# Altium schematic sheet rhd_board.SchDoc
size A4
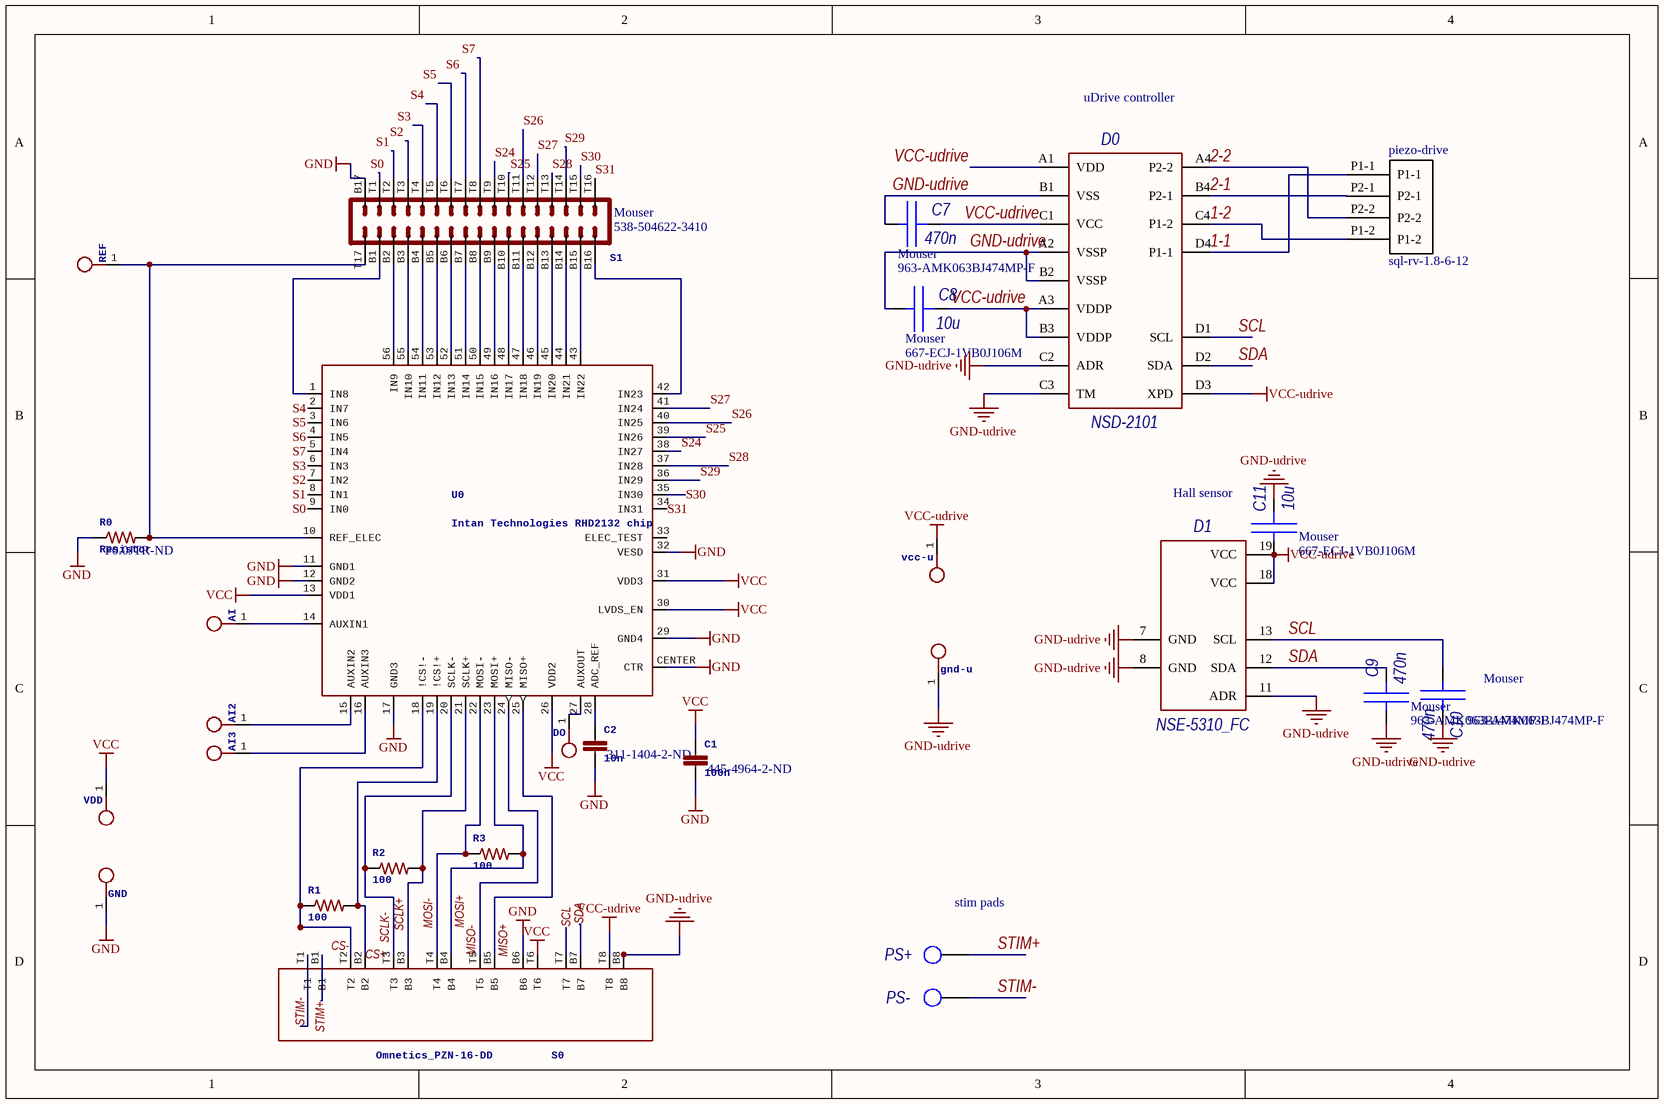
[diagram p0: rhd_board.SchDoc]

## Parts
AI  PCB Test Point  [TESTPOINT_SMALL]  (value not drawn)
AI2  PCB Test Point  [TESTPOINT_SMALL]  (value not drawn)
AI3  PCB Test Point  [TESTPOINT_SMALL]  (value not drawn)
C1  100n  Supplier Part Number 1: 445-4964-2-ND  [0402]
C2  10n  Supplier Part Number 1: 311-1404-2-ND  [0201]
C7  470n  Supplier 1: Mouser  Supplier Part Number 1: 963-AMK063BJ474MP-F  [CAPC0603X03L]
C8  10u  Supplier 1: Mouser  Supplier Part Number 1: 667-ECJ-1VB0J106M  [CAPC1608X09L]
C9  470n  Supplier 1: Mouser  Supplier Part Number 1: 963-AMK063BJ474MP-F  [CAPC0603X03L]
C10  470n  Supplier 1: Mouser  Supplier Part Number 1: 963-AMK063BJ474MP-F  [CAPC0603X03L]
C11  10u  Supplier 1: Mouser  Supplier Part Number 1: 667-ECJ-1VB0J106M  [CAPC1608X09L]
D0  NSD-2101  [BGA16C40P4X4_175X175X63]
D1  NSE-5310_FC  [NSE-5310_FC]
DO  PCB Test Point  [TESTPOINT_SMALL]  (value not drawn)
GND  PCB Test Point  [TESTPOINT_SMALL]  (value not drawn)
gnd-u  PCB Test Point  [TESTPOINT_SMALL]  (value not drawn)
piezo-drive  sql-rv-1.8-6-12  [sql-rv-1.8-6-12]
PS+  2-2  [KP-025-04]  (value not drawn)
PS-  2-2  [KP-025-04]  (value not drawn)
R0  Resistor  Supplier Part Number 1: P0.0JTR-ND  [0402]
R1  100  [0201]
R2  100  [0201]
R3  100  [0201]
REF  PCB Test Point  [TESTPOINT_SMALL]  (value not drawn)
S0  Omnetics_PZN-16-DD  [OMNETICS_PZN-16-DD]
S1  Supplier 1: Mouser  Supplier Part Number 1: 538-504622-3410  [MOLEX_504622-3412]  (hidden comment: Molex 3.5mm Pitch Slimstack 34 pin connector)
U0  Intan Technologies RHD2132 chip  [RHD2000_56PIN_COB]
vcc-u  PCB Test Point  [TESTPOINT_SMALL]  (value not drawn)
VDD  PCB Test Point  [TESTPOINT_SMALL]  (value not drawn)

## Nets
GND: C1.2 C2.2 GND.1 R0.1 S0.B6 S1.B17 U0.11(GND1) U0.12(GND2) U0.17(GND3) U0.29(GND4) U0.32(VESD) U0.CENTER(CTR)
GND-udrive: C7.1 C8.1 C9.1 C10.2 C11.2 D0.A2(VSSP) D0.B1(VSS) D0.B2(VSSP) D0.C2(ADR) D0.C3(TM) D1.7(GND) D1.8(GND) D1.11(ADR) gnd-u.1 S0.B8
VCC: C1.1 S0.T6 U0.13(VDD1) U0.26(VDD2) U0.30(LVDS_EN) U0.31(VDD3) VDD.1
VCC-udrive: C7.2 C8.2 C11.1 D0.A1(VDD) D0.A3(VDDP) D0.B3(VDDP) D0.C1(VCC) D0.D3(XPD) D1.18(VCC) D1.19(VCC) S0.T8 vcc-u.1
1-1: D0.D4(P1-1) piezo-drive.P1-1
1-2: D0.C4(P1-2) piezo-drive.P1-2
2-1: D0.B4(P2-1) piezo-drive.P2-1
2-2: D0.A4(P2-2) piezo-drive.P2-2
CS+: R1.2 S0.B2 U0.19(!CS!+)
CS-: R1.1 S0.T2 U0.18(!CS!-)
MISO+: S0.B5 U0.25(MISO+)
MISO-: S0.T5 U0.24(MISO-)
MOSI+: R3.2 S0.B4 U0.23(MOSI+)
MOSI-: R3.1 S0.T4 U0.22(MOSI-)
S0: S1.T1 U0.9(IN0)
S1: S1.T2 U0.8(IN1)
S2: S1.T3 U0.7(IN2)
S3: S1.T4 U0.6(IN3)
S4: S1.T5 U0.2(IN7)
S5: S1.T6 U0.3(IN6)
S6: S1.T7 U0.4(IN5)
S7: S1.T8 U0.5(IN4)
S24: S1.T9 U0.38(IN27)
S25: S1.T10 U0.39(IN26)
S26: S1.T11 U0.40(IN25)
S27: S1.T12 U0.41(IN24)
S28: S1.T13 U0.37(IN28)
S29: S1.T14 U0.36(IN29)
S30: S1.T15 U0.35(IN30)
S31: S1.T16 U0.34(IN31)
SCL: C10.1 D0.D1(SCL) D1.13(SCL) S0.T7
SCLK+: R2.2 S0.B3 U0.21(SCLK+)
SCLK-: R2.1 S0.T3 U0.20(SCLK-)
SDA: C9.2 D0.D2(SDA) D1.12(SDA) S0.B7
STIM+: PS+.1 S0.B1
STIM-: PS-.1 S0.T1
NetAI2_1: AI2.1 U0.15(AUXIN2)
NetAI3_1: AI3.1 U0.16(AUXIN3)
NetAI_1: AI.1 U0.14(AUXIN1)
NetC2_1: C2.1 U0.28(ADC_REF)
NetDO_1: DO.1 U0.27(AUXOUT)
NetR0_2: R0.2 REF.1 S1.T17 U0.10(REF_ELEC)
NetS1_B1: S1.B1 U0.1(IN8)
NetS1_B2: S1.B2 U0.56(IN9)
NetS1_B3: S1.B3 U0.55(IN10)
NetS1_B4: S1.B4 U0.54(IN11)
NetS1_B5: S1.B5 U0.53(IN12)
NetS1_B6: S1.B6 U0.52(IN13)
NetS1_B7: S1.B7 U0.51(IN14)
NetS1_B8: S1.B8 U0.50(IN15)
NetS1_B9: S1.B9 U0.49(IN16)
NetS1_B10: S1.B10 U0.48(IN17)
NetS1_B11: S1.B11 U0.47(IN18)
NetS1_B12: S1.B12 U0.46(IN19)
NetS1_B13: S1.B13 U0.45(IN20)
NetS1_B14: S1.B14 U0.44(IN21)
NetS1_B15: S1.B15 U0.43(IN22)
NetS1_B16: S1.B16 U0.42(IN23)

Not connected (* = marked no-connect by the designer): U0 33(ELEC_TEST)

## Notes on the sheet
- uDrive controller
- (near C11) Hall sensor
- (near PS+) stim pads

## Library data of the parts
AI AI2 AI3 DO GND gnd-u REF vcc-u VDD = TESTPOINT_SMALL: GateName_1: TP$1; DeviceName: _SMALL; SymbolName_1: TESTPOINT; LibraryName: RHD2000_eval_board; DeviceSetName: TESTPOINT; Package: TESTPOINT_SMALL
C1 = C_100nf: ceramic capacitor (25 V). For pwer supply decoupling; GateName_1: C; DeviceName: _0402; SymbolName_1: C; LibraryName: RHD2000_eval_board; DeviceSetName: C; Package: 0402; Supplier 1: Digi-Key
C2 = C_10nF: ceramic 16v; GateName_1: C; DeviceName: _0201; SymbolName_1: C; LibraryName: RHD2000_eval_board; DeviceSetName: C; Package: 0201; Supplier 1: Digi-Key
C7 C9 C10 = Cap-603: Capacitor; LatestRevisionDate: 10-Jul-2010; Publisher: RVS
C8 C11 = Cap-1608: Capacitor; LatestRevisionDate: 10-Jul-2010; Publisher: RVS
piezo-drive = sql-rv-1.8-6-12: Squiggle motor
PS+ PS- = KP-025X04
R0 = R_0ohm: resistor 0ohm; GateName_1: R; DeviceName: _0402; SymbolName_1: R; LibraryName: RHD2000_eval_board; DeviceSetName: R; Package: 0402; Supplier 1: Digi-Key
R1-R3 = R_100_LVDS: 100ohm resistor for lvds pair in 64ch; GateName_1: R; DeviceName: _0201; SymbolName_1: R; LibraryName: RHD2000_eval_board; DeviceSetName: R; Package: 0201; Supplier 1: Digi-Key; Supplier Part Number 1: ERJ-1GNF1000C-ND
S0 = Omnetics_PZN-16-DD: GateName_1: A; SymbolName_1: RHD2000-CABLE; DeviceSetName: RHD2000-CABLE-DAQ-SIDE; LibraryName: RHD2000_eval_board; Package: OMNETICS_PZN-12-AA
S1 = MOLEX_504622-3412: GateName_1: A; SymbolName_1: OMNETICS_A7902X; DeviceSetName: OMNETICS_A79024; LibraryName: RHD2000_eval_board; Package: OMNETICS_A79024
U0 = RHD2132_COB: GateName_1: A; DeviceName: _COB; SymbolName_1: RHD2132; LibraryName: RHD2000; DeviceSetName: RHD2132; Package: RHD2000_56PIN_COB